# EAGLE schematic J533 harness (EAGLE 9.6.2)

## Sheet 1 of 2: Basic J533 harness that requires comma power
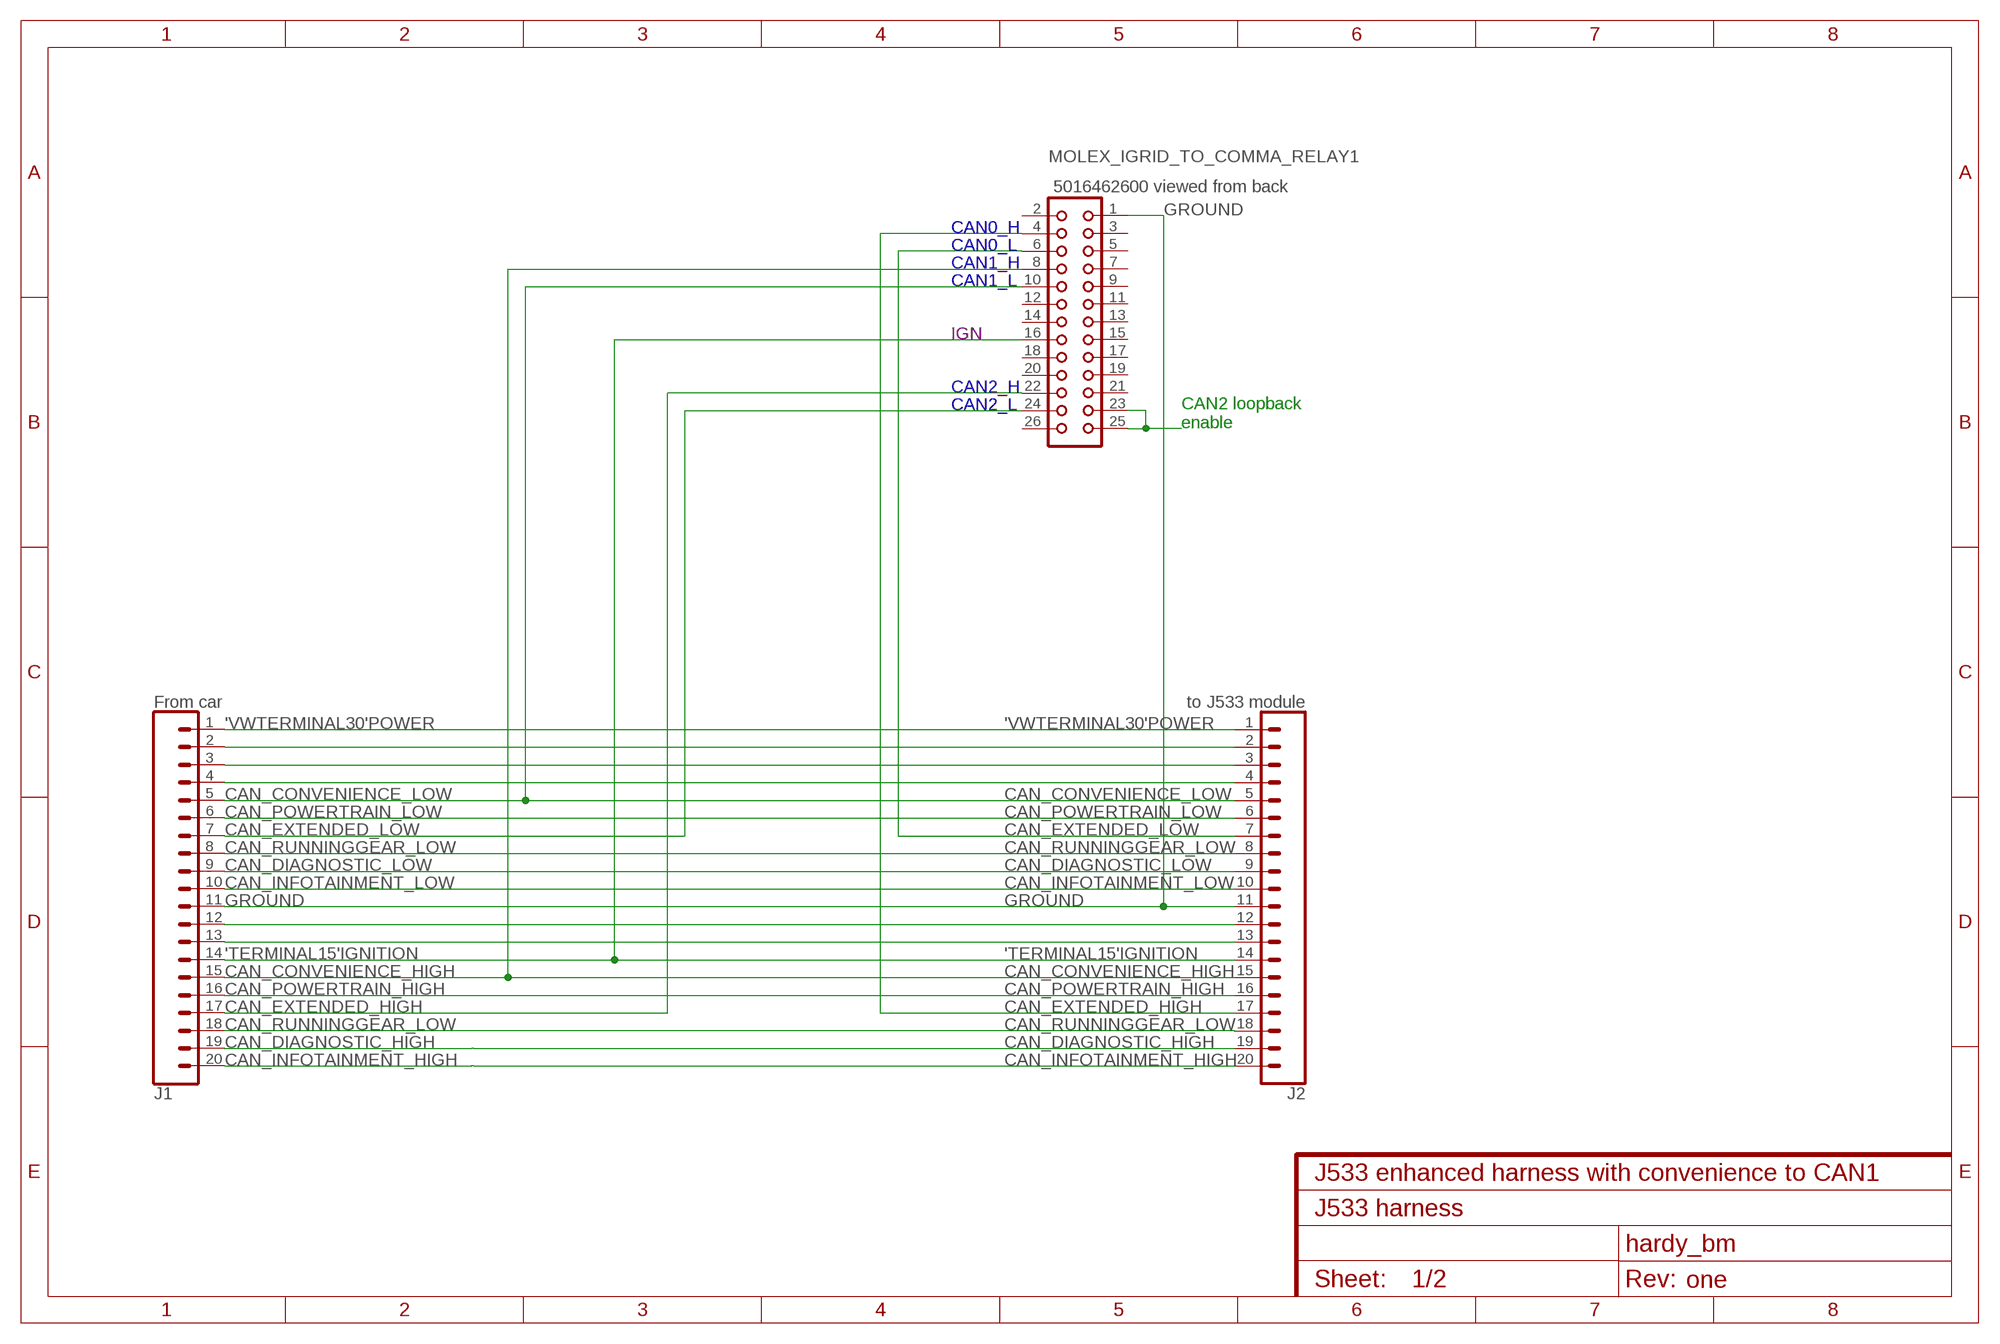
[diagram p0: schematic, sheet 1]
FRAME1 (FRAME-A4L): CNAME: J533 enhanced harness with convenience to CAN1; CREVISION: one; DESIGNER: hardy_bm

### Parts
J1  From car  CONN_20  [1X20]
J2  to J533 module  CONN_20  [1X20]
MOLEX_IGRID_TO_COMMA_RELAY1  5016462600 viewed from back  CON26  [CON26]

### Nets
'TERMINAL15'IGNITION: J1.14 J2.14 MOLEX_IGRID_TO_COMMA_RELAY1.16
'VWTERMINAL30'POWER: J1.1 J2.1 ; also sheet 2
CAN_CONVENIENCE_HIGH: J1.15 J2.15 MOLEX_IGRID_TO_COMMA_RELAY1.8 ; also sheet 2
CAN_CONVENIENCE_LOW: J1.5 J2.5 MOLEX_IGRID_TO_COMMA_RELAY1.10 ; also sheet 2
CAN_DIAGNOSTIC_HIGH: J1.19 J2.19 ; also sheet 2
CAN_DIAGNOSTIC_LOW: J1.9 J2.9 ; also sheet 2
CAN_EXTENDED_HIGH: J1.17 MOLEX_IGRID_TO_COMMA_RELAY1.22 ; also sheet 2
CAN_EXTENDED_LOW: J1.7 MOLEX_IGRID_TO_COMMA_RELAY1.24 ; also sheet 2
CAN_INFOTAINMENT_HIGH: J1.20 J2.20 ; also sheet 2
CAN_INFOTAINMENT_LOW: J1.10 J2.10 ; also sheet 2
CAN_POWERTRAIN_HIGH: J1.16 J2.16 ; also sheet 2
CAN_POWERTRAIN_LOW: J1.6 J2.6 ; also sheet 2
CAN_RUNNINGGEAR_LOW: J1.8 J1.18 J2.8 J2.18 ; also sheet 2
GROUND: J1.11 J2.11 MOLEX_IGRID_TO_COMMA_RELAY1.1
GROUND_IN_MQB_ONLY_DONT_RELY_ON_IT: J1.12 J2.12 ; also sheet 2
N$2: J1.2 J2.2
N$3: J1.3 J2.3
N$4: MOLEX_IGRID_TO_COMMA_RELAY1.23 MOLEX_IGRID_TO_COMMA_RELAY1.25
N$5: J2.7 MOLEX_IGRID_TO_COMMA_RELAY1.6
N$7: J2.17 MOLEX_IGRID_TO_COMMA_RELAY1.4
N$13: J1.13 J2.13
NOT_USED: J1.4 J2.4 ; also sheet 2
Unconnected: MOLEX_IGRID_TO_COMMA_RELAY1.2 MOLEX_IGRID_TO_COMMA_RELAY1.3 MOLEX_IGRID_TO_COMMA_RELAY1.5 MOLEX_IGRID_TO_COMMA_RELAY1.7 MOLEX_IGRID_TO_COMMA_RELAY1.9 MOLEX_IGRID_TO_COMMA_RELAY1.11 MOLEX_IGRID_TO_COMMA_RELAY1.12 MOLEX_IGRID_TO_COMMA_RELAY1.13 MOLEX_IGRID_TO_COMMA_RELAY1.14 MOLEX_IGRID_TO_COMMA_RELAY1.15 MOLEX_IGRID_TO_COMMA_RELAY1.17 MOLEX_IGRID_TO_COMMA_RELAY1.18 MOLEX_IGRID_TO_COMMA_RELAY1.19 MOLEX_IGRID_TO_COMMA_RELAY1.20 MOLEX_IGRID_TO_COMMA_RELAY1.21 MOLEX_IGRID_TO_COMMA_RELAY1.26

### Notes on the sheet
- CAN0_H
- CAN0_L
- CAN1_H
- CAN1_L
- IGN
- CAN2_H
- CAN2_L
- CAN2 loopback 
  enable
- CAN_EXTENDED_LOW
- CAN_EXTENDED_HIGH

## Sheet 2 of 2: Dream J533 harness that doesn't require comma power
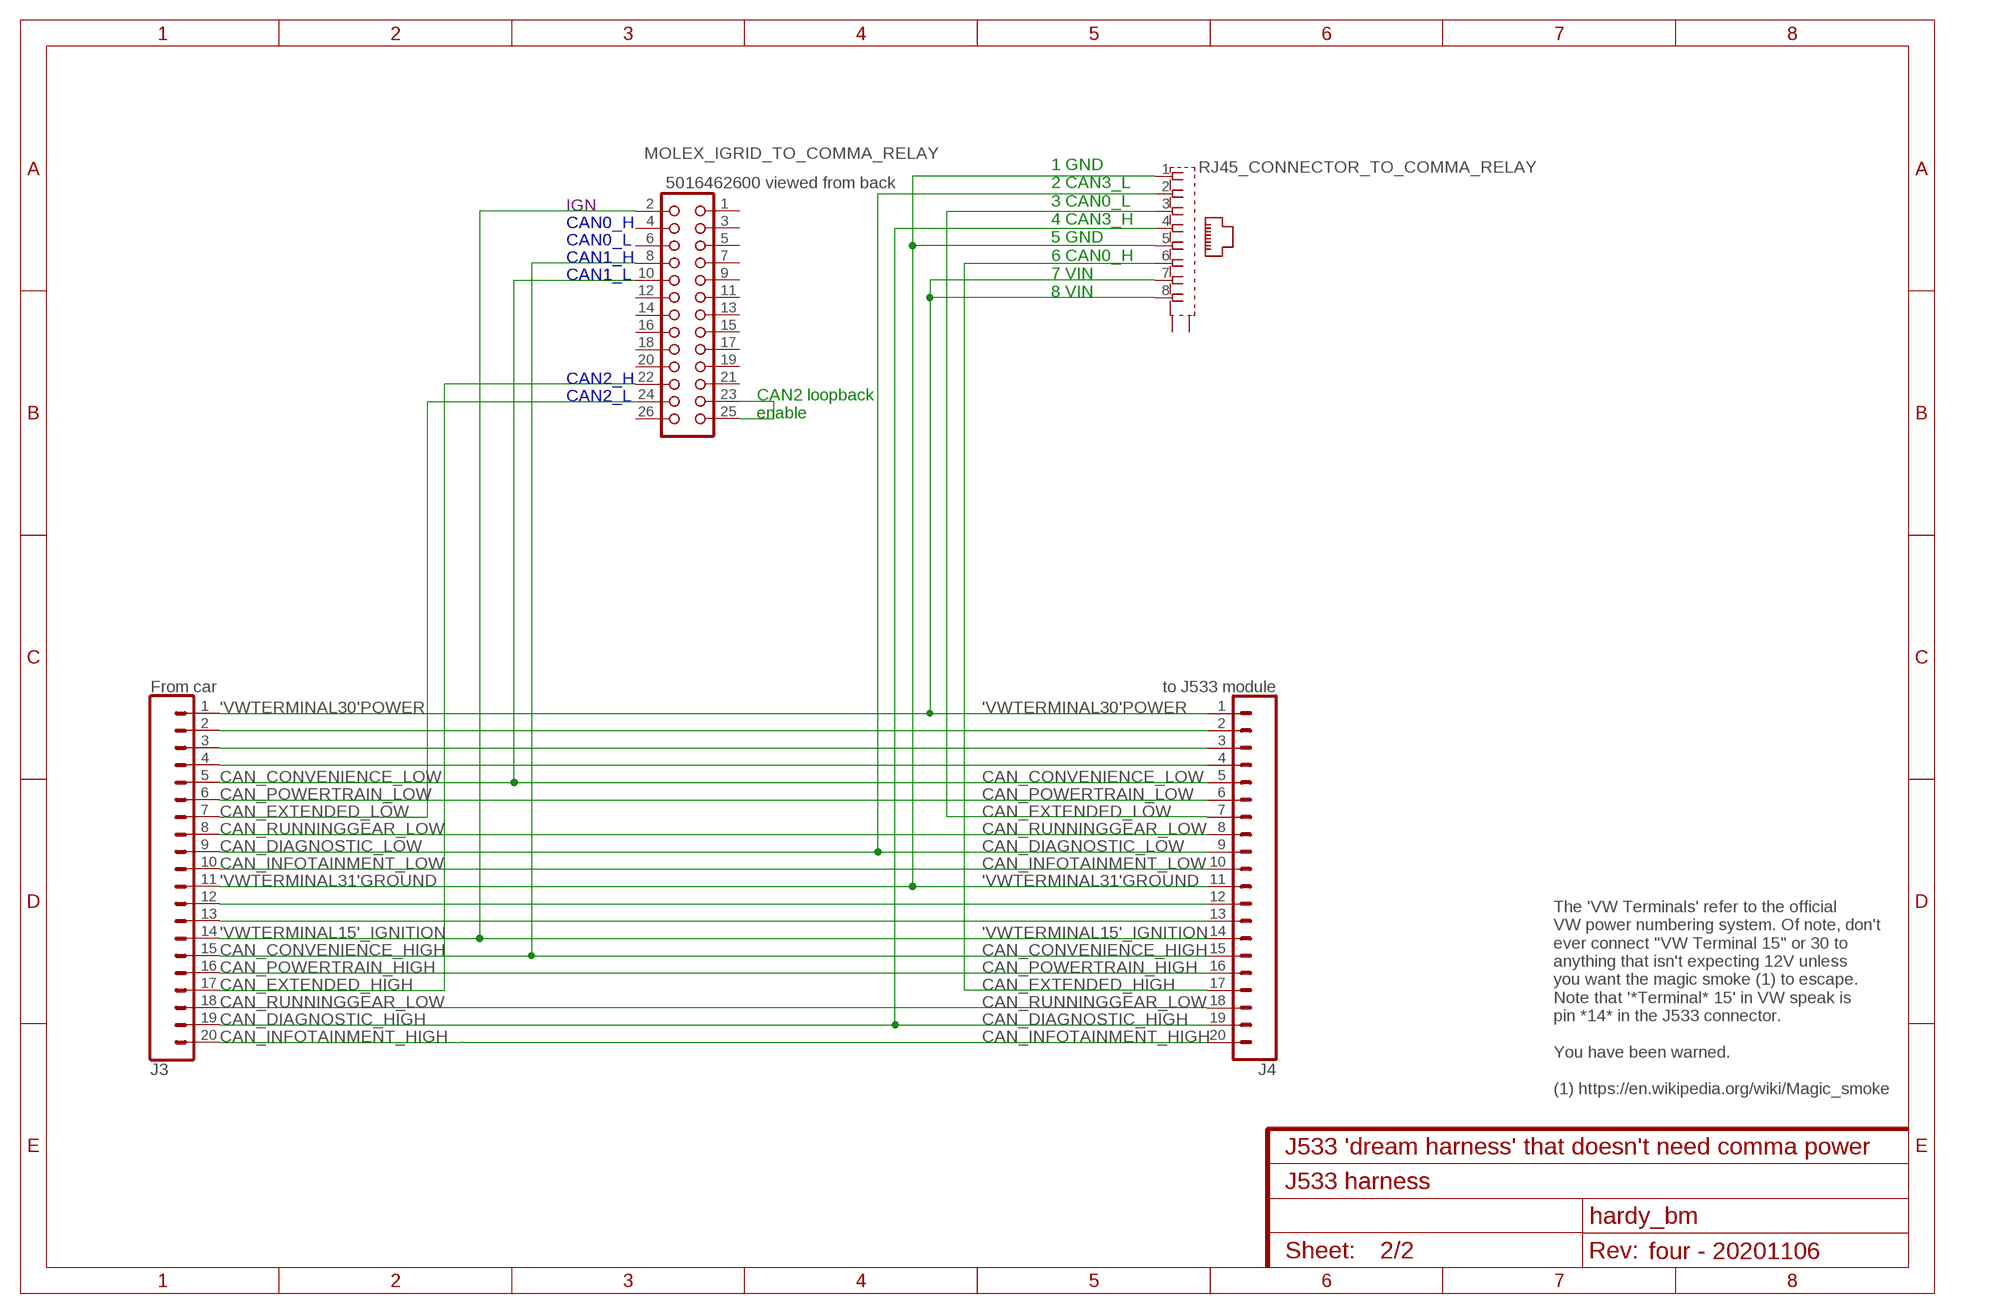
[diagram p1: schematic, sheet 2]
FRAME2 (FRAME-A4L): CNAME: J533 'dream harness' that doesn't need comma power; CREVISION: four - 20201106; DESIGNER: hardy_bm

### Parts
J3  From car  CONN_20  [1X20]
J4  to J533 module  CONN_20  [1X20]
MOLEX_IGRID_TO_COMMA_RELAY  5016462600 viewed from back  CON26  [CON26]
RJ45_CONNECTOR_TO_COMMA_RELAY  GLX-S-88M  [GLX-S-88M]

### Nets
'VWTERMINAL15'_IGNITION: J3.14 J4.14 MOLEX_IGRID_TO_COMMA_RELAY.2
'VWTERMINAL30'POWER: J3.1 J4.1 RJ45_CONNECTOR_TO_COMMA_RELAY.7 RJ45_CONNECTOR_TO_COMMA_RELAY.8 ; also sheet 1
'VWTERMINAL31'GROUND: J3.11 J4.11 RJ45_CONNECTOR_TO_COMMA_RELAY.1 RJ45_CONNECTOR_TO_COMMA_RELAY.5
CAN_CONVENIENCE_HIGH: J3.15 J4.15 MOLEX_IGRID_TO_COMMA_RELAY.8 ; also sheet 1
CAN_CONVENIENCE_LOW: J3.5 J4.5 MOLEX_IGRID_TO_COMMA_RELAY.10 ; also sheet 1
CAN_DIAGNOSTIC_HIGH: J3.19 J4.19 RJ45_CONNECTOR_TO_COMMA_RELAY.4 ; also sheet 1
CAN_DIAGNOSTIC_LOW: J3.9 J4.9 RJ45_CONNECTOR_TO_COMMA_RELAY.2 ; also sheet 1
CAN_EXTENDED_HIGH: J3.17 MOLEX_IGRID_TO_COMMA_RELAY.22 ; also sheet 1
CAN_EXTENDED_LOW: J3.7 MOLEX_IGRID_TO_COMMA_RELAY.24 ; also sheet 1
CAN_INFOTAINMENT_HIGH: J3.20 J4.20 ; also sheet 1
CAN_INFOTAINMENT_LOW: J3.10 J4.10 ; also sheet 1
CAN_POWERTRAIN_HIGH: J3.16 J4.16 ; also sheet 1
CAN_POWERTRAIN_LOW: J3.6 J4.6 ; also sheet 1
CAN_RUNNINGGEAR_LOW: J3.8 J3.18 J4.8 J4.18 ; also sheet 1
GROUND_IN_MQB_ONLY_DONT_RELY_ON_IT: J3.12 J4.12 ; also sheet 1
J367LINBUS: J3.3 J3.13 J4.3 J4.13
N$1: J3.2 J4.2
N$12: J4.7 RJ45_CONNECTOR_TO_COMMA_RELAY.3
N$14: J4.17 RJ45_CONNECTOR_TO_COMMA_RELAY.6
N$15: MOLEX_IGRID_TO_COMMA_RELAY.23 MOLEX_IGRID_TO_COMMA_RELAY.25
NOT_USED: J3.4 J4.4 ; also sheet 1
Unconnected: MOLEX_IGRID_TO_COMMA_RELAY.1 MOLEX_IGRID_TO_COMMA_RELAY.3 MOLEX_IGRID_TO_COMMA_RELAY.4 MOLEX_IGRID_TO_COMMA_RELAY.5 MOLEX_IGRID_TO_COMMA_RELAY.6 MOLEX_IGRID_TO_COMMA_RELAY.7 MOLEX_IGRID_TO_COMMA_RELAY.9 MOLEX_IGRID_TO_COMMA_RELAY.11 MOLEX_IGRID_TO_COMMA_RELAY.12 MOLEX_IGRID_TO_COMMA_RELAY.13 MOLEX_IGRID_TO_COMMA_RELAY.14 MOLEX_IGRID_TO_COMMA_RELAY.15 MOLEX_IGRID_TO_COMMA_RELAY.16 MOLEX_IGRID_TO_COMMA_RELAY.17 MOLEX_IGRID_TO_COMMA_RELAY.18 MOLEX_IGRID_TO_COMMA_RELAY.19 MOLEX_IGRID_TO_COMMA_RELAY.20 MOLEX_IGRID_TO_COMMA_RELAY.21 MOLEX_IGRID_TO_COMMA_RELAY.26 RJ45_CONNECTOR_TO_COMMA_RELAY.S1 RJ45_CONNECTOR_TO_COMMA_RELAY.S2

### Notes on the sheet
- IGN
- CAN0_H
- CAN0_L
- CAN1_H
- CAN1_L
- 1 GND
  2 CAN3_L
  3 CAN0_L
  4 CAN3_H
  5 GND
  6 CAN0_H
  7 VIN
  8 VIN
- CAN2_H
- CAN2_L
- CAN2 loopback 
  enable
- CAN_EXTENDED_LOW
- CAN_EXTENDED_HIGH
- The 'VW Terminals' refer to the official 
  VW power numbering system. Of note, don't 
  ever connect "VW Terminal 15" or 30 to 
  anything that isn't expecting 12V unless 
  you want the magic smoke (1) to escape. 
  Note that '*Terminal* 15' in VW speak is 
  pin *14* in the J533 connector. 
  
  You have been warned.
  
  (1) https://en.wikipedia.org/wiki/Magic_smoke

## Library data of the parts
J1-J4 = SparkFun-Connectors:CONN_20: Multi connection point. Often used as Generic Header-pin footprint for 0.1 inch spaced/style header connections On any of the 0.1 inch spaced packages, you can populate with these: Break Away Headers - Straight <https://www.sparkfun.com/products/116> (PRT-00116) Break Away Male Headers - Right Angle <https://www.sparkfun.com/products/553> (PRT-00553) Female Headers <https://www.sparkfun.com/products/115> (PRT-00115) Break Away Headers - Machine Pin <https://www.sparkfun.com/products/117> (PRT-00117) Break Away Female Headers - Swiss Machine Pin <https://www.sparkfun.com/products/743> (PRT-00743) For SCREWTERMINALS and SPRING TERMINALS visit here: Screw Terimnals on SparkFun.com <https://www.sparkfun.com/search/results?term=Screw+Terminals> (5mm/3.5mm/2.54mm spacing) This device is also useful as a general connection point to wire up your design to another part of your project. Our various solder wires solder well into these plated through hole pads. Hook-Up Wire - Assortment (Stranded, 22 AWG) <https://www.sparkfun.com/products/11375> (PRT-11375) Hook-Up Wire - Assortment (Solid Core, 22 AWG) <https://www.sparkfun.com/products/11367> (PRT-11367) View the entire wire category on our website here <https://www.sparkfun.com/categories/141> Special notes: Molex polarized connector foot print use with SKU : PRT-08231 with associated crimp pins and housings. 1MM SMD Version SKU: PRT-10208 NOTES ON THE VARIANTS LOCK and LOCK_LONGPADS... This footprint was designed to help hold the alignment of a through-hole component (i.e. 6-pin header) while soldering it into place. You may notice that each hole has been shifted either up or down by 0.005 of an inch from it's more standard position (which is a perfectly straight line). This slight alteration caused the pins (the squares in the middle) to touch the edges of the holes. Because they are alternating, it causes a "brace" to hold the component in place. 0.005 has proven to be the perfect amount of "off-center" position when using our standard breakaway headers. Although looks a little odd when you look at the bare footprint, once you have a header in there, the alteration is very hard to notice. Also,if you push a header all the way into place, it is covered up entirely on the bottom side. Note about LOCK SPECIAL package: This is just like the LOCK variant in that the holes are staggared by 5 mil, but except for the last two holes. They are not altered from the "standard" footprint layout. This is used for a special purpose on the layout of our Graphic LCD Backpack. Make sure you want to use this device before selecting it for you project!
MOLEX_IGRID_TO_COMMA_RELAY MOLEX_IGRID_TO_COMMA_RELAY1 = con-harting:CON26: CONNECTOR; OC_FARNELL: unknown; OC_NEWARK: unknown
RJ45_CONNECTOR_TO_COMMA_RELAY = con-kycon:GLX-S-88M: Mod. Jack, Right Angle, 8 posiotion, 8 contatcs RJ45 Source: GLX-S-88M.pdf; OC_FARNELL: unknown; OC_NEWARK: unknown